# Altium schematic sheet zx-SD-Card_SPI.SchDoc
size 420 x 297 mm
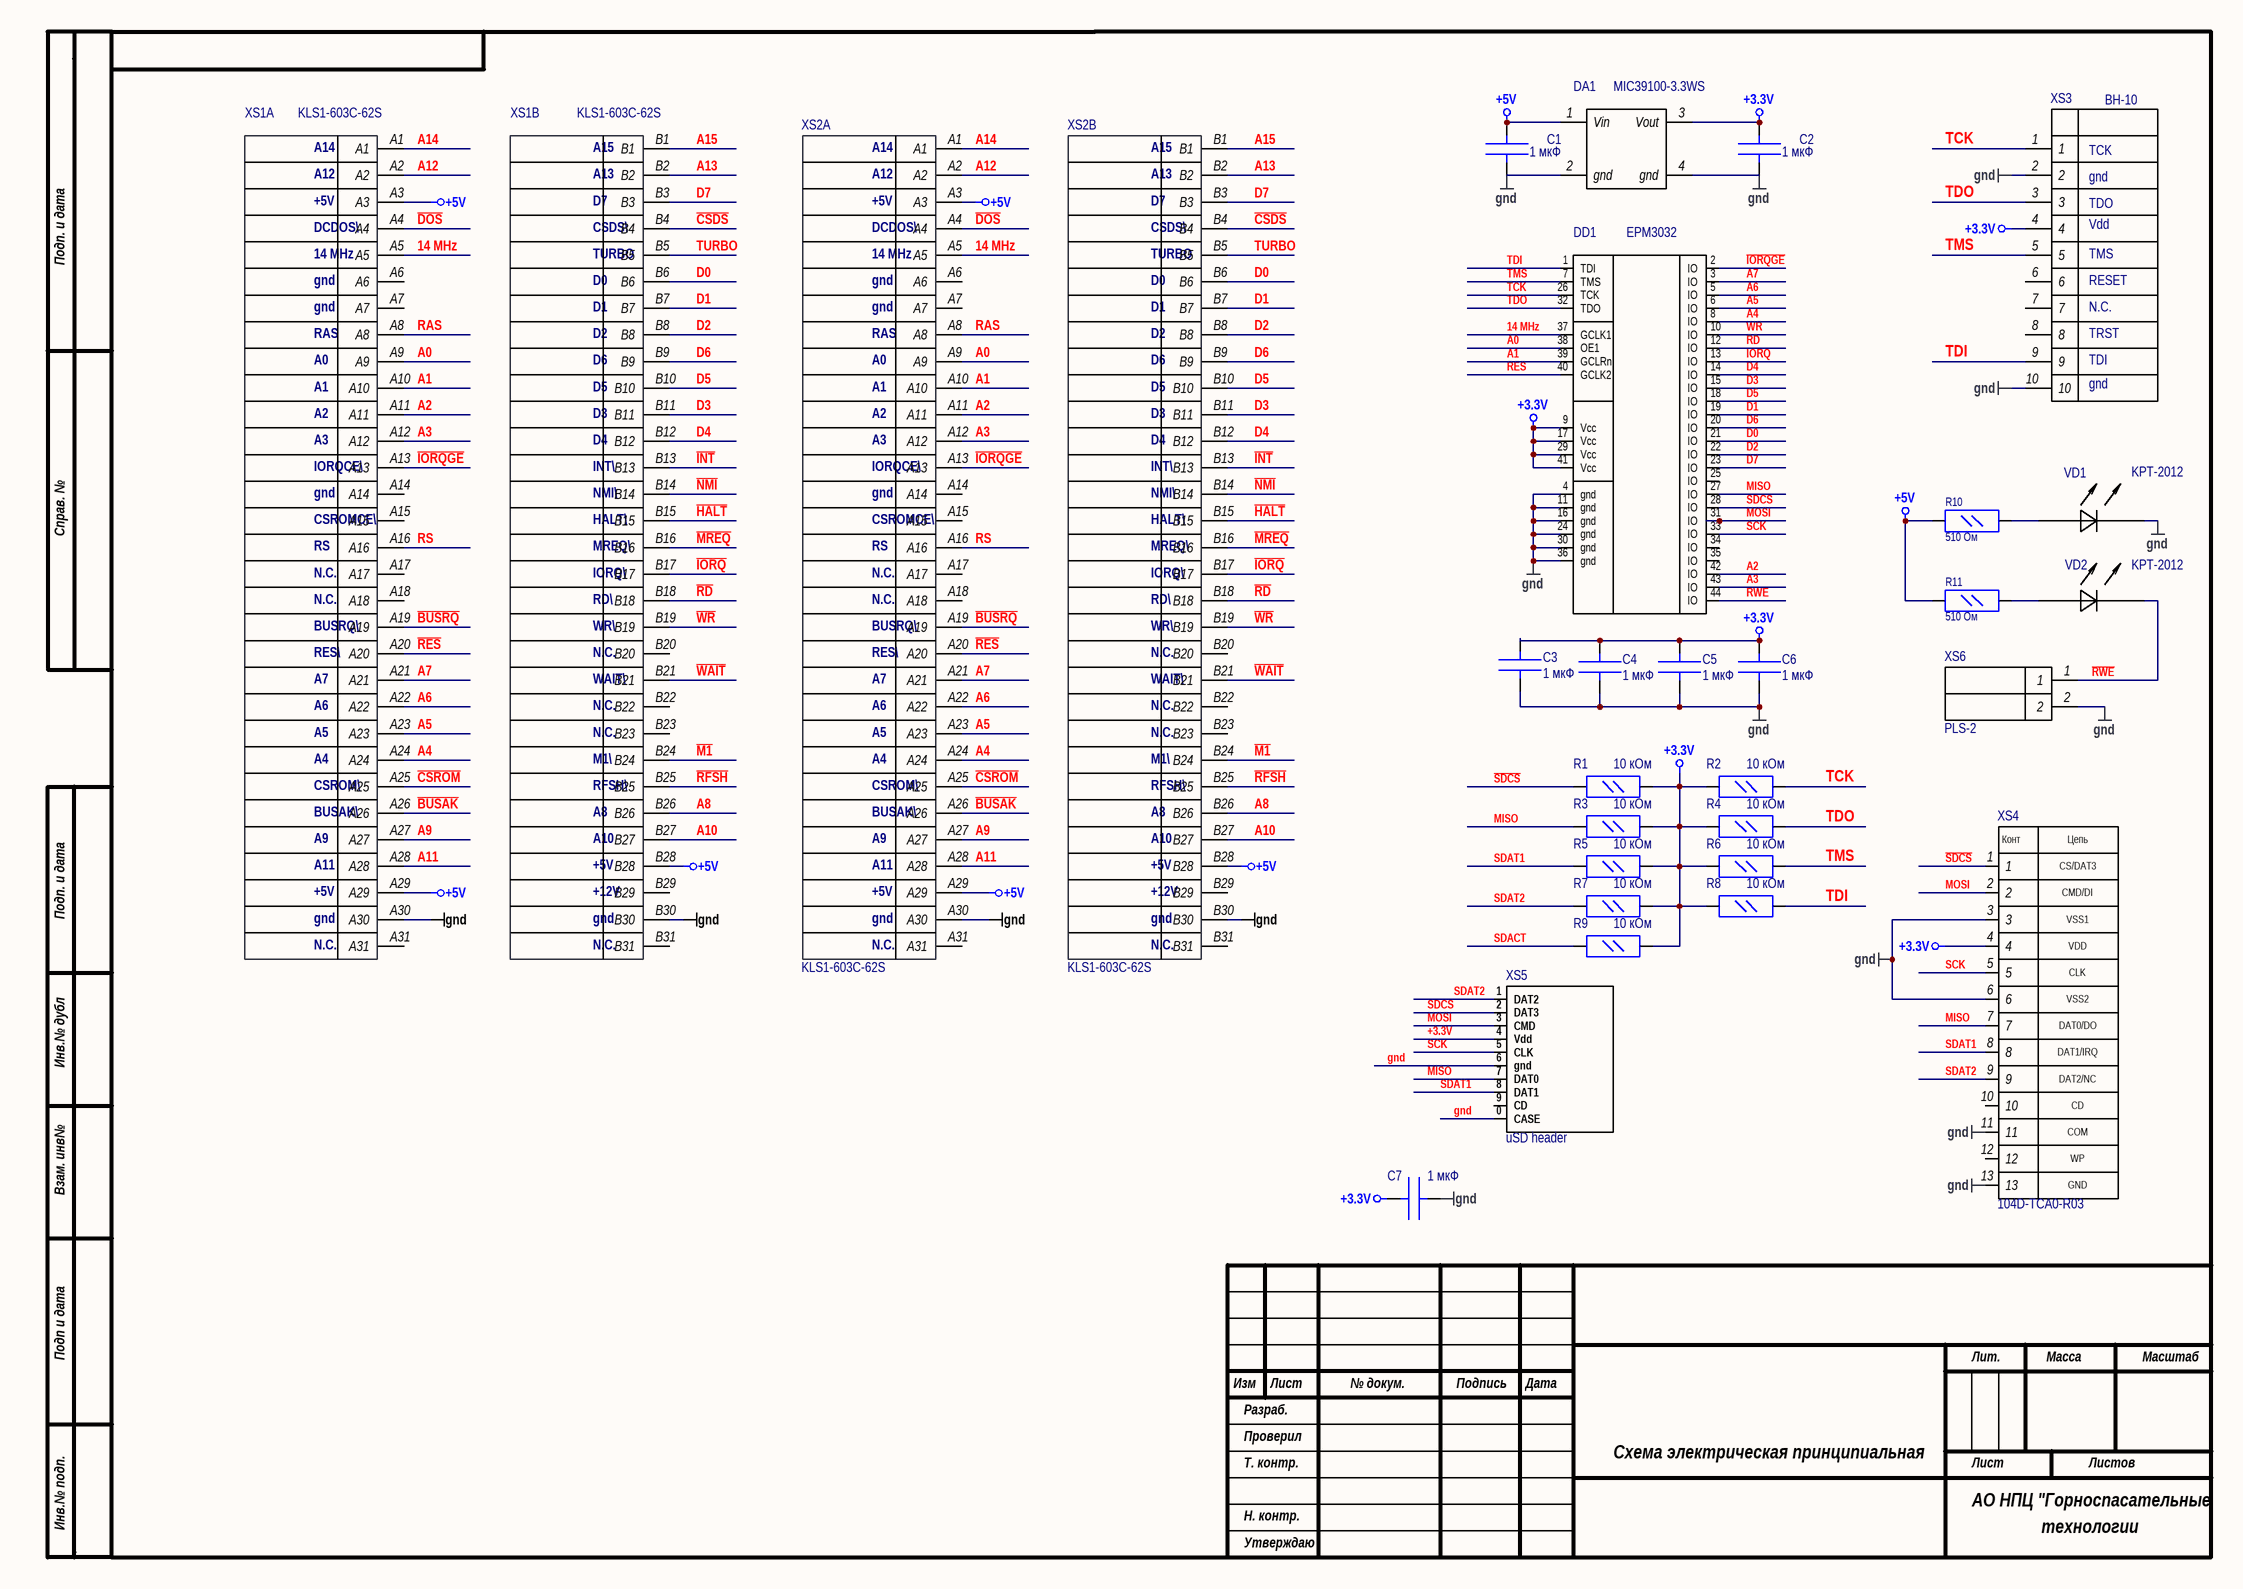
[diagram p0: zx-SD-Card_SPI.SchDoc]

## Parts
C1  1 мкФ  [CAP C 3216 (1206) 1.9h]
C2  1 мкФ  [CAP C 3216 (1206) 1.9h]
C3  1 мкФ  [CAP C 2012 (0805) 1.45h]
C4  1 мкФ  [CAP C 2012 (0805) 1.45h]
C5  1 мкФ  [CAP C 2012 (0805) 1.45h]
C6  1 мкФ  [CAP C 2012 (0805) 1.45h]
C7  1 мкФ  [CAP C 2012 (0805) 1.45h]
DA1  MIC39100-3.3WS  [MIC39100-3.3WS]
DD1  EPM3032  [ALTERA TQFP-44]
R1  10 кОм  [RES C 2012 (0805) 0.65h]
R2  10 кОм  [RES C 2012 (0805) 0.65h]
R3  10 кОм  [RES C 2012 (0805) 0.65h]
R4  10 кОм  [RES C 2012 (0805) 0.65h]
R5  10 кОм  [RES C 2012 (0805) 0.65h]
R6  10 кОм  [RES C 2012 (0805) 0.65h]
R7  10 кОм  [RES C 2012 (0805) 0.65h]
R8  10 кОм  [RES C 2012 (0805) 0.65h]
R9  10 кОм  [RES C 2012 (0805) 0.65h]
R10  510 Ом  [RES C 2012 (0805) 0.65h]
R11  510 Ом  [RES C 2012 (0805) 0.65h]
VD1  KPT-2012  [KPT-2012]
VD2  KPT-2012  [KPT-2012]
XS1  KLS1-603C-62S  [KLS1-603 ISA]  (parts A,B of 2)
XS2  KLS1-603C-62S  [KLS1-603C-64S]  (parts A,B of 2)
XS3  BH-10  [BH-10]
XS4  104D-TCA0-R03  [104D-TCA0-R03]
XS5  uSD header  [uSD]
XS6  PLS-2  [PLS-2]

## Nets
+3.3V: C2.2 C3.1 C4.1 C5.1 C6.1 C7.1 DA1.3(Vout) DD1.9(Vcc) DD1.17(Vcc) DD1.29(Vcc) DD1.41(Vcc) R1.2 R2.1 R3.2 R4.1 R5.2 R6.1 R7.2 R8.1 R9.2 XS3.4 XS4.4 XS5.4(Vdd)
+5V: C1.2 DA1.1(Vin) R10.1 R11.1 XS1.A3 XS1.A29 XS1.B28 XS2.A3 XS2.A29 XS2.B28
gnd: C1.1 C2.1 C3.2 C4.2 C5.2 C6.2 C7.2 DA1.2(gnd) DA1.4(gnd) DD1.4(gnd) DD1.11(gnd) DD1.16(gnd) DD1.24(gnd) DD1.30(gnd) DD1.36(gnd) VD1.2 XS1.A30 XS1.B30 XS2.A30 XS2.B30 XS3.2 XS3.10 XS4.3 XS4.6 XS4.11 XS4.13 XS5.0(CASE) XS5.6(gnd) XS6.2
14 MHz: DD1.37(GCLK1) XS1.A5 XS2.A5
A0: DD1.38(OE1) XS1.A9 XS2.A9
A1: DD1.39(GCLRn) XS1.A10 XS2.A10
A2: DD1.42(IO) XS1.A11 XS2.A11
A3: DD1.43(IO) XS1.A12 XS2.A12
A4: DD1.8(IO) XS1.A24 XS2.A24
A5: DD1.6(IO) XS1.A23 XS2.A23
A6: DD1.5(IO) XS1.A22 XS2.A22
A7: DD1.3(IO) XS1.A21 XS2.A21
A8: XS1.B26 XS2.B26
A9: XS1.A27 XS2.A27
A10: XS1.B27 XS2.B27
A11: XS1.A28 XS2.A28
A12: XS1.A2 XS2.A2
A13: XS1.B2 XS2.B2
A14: XS1.A1 XS2.A1
A15: XS1.B1 XS2.B1
~{BUSAK}: XS1.A26 XS2.A26
~{BUSRQ}: XS1.A19 XS2.A19
~{CSDS}: XS1.B4 XS2.B4
~{CSROM}: XS1.A25 XS2.A25
D0: DD1.21(IO) XS1.B6 XS2.B6
D1: DD1.19(IO) XS1.B7 XS2.B7
D2: DD1.22(IO) XS1.B8 XS2.B8
D3: DD1.15(IO) XS1.B11 XS2.B11
D4: DD1.14(IO) XS1.B12 XS2.B12
D5: DD1.18(IO) XS1.B10 XS2.B10
D6: DD1.20(IO) XS1.B9 XS2.B9
D7: DD1.23(IO) XS1.B3 XS2.B3
~{DOS}: XS1.A4 XS2.A4
~{HALT}: XS1.B15 XS2.B15
~{INT}: XS1.B13 XS2.B13
~{IORQ}: DD1.13(IO) XS1.B17 XS2.B17
~{IORQGE}: DD1.2(IO) XS1.A13 XS2.A13
~{M1}: XS1.B24 XS2.B24
~{MREQ}: XS1.B16 XS2.B16
MISO: DD1.27(IO) R3.1 XS4.7 XS5.7(DAT0)
MOSI: DD1.31(IO) XS4.2 XS5.3(CMD)
~{NMI}: XS1.B14 XS2.B14
~{RD}: DD1.12(IO) XS1.B18 XS2.B18
~{RES}: DD1.40(GCLK2) XS1.A20 XS2.A20
~{RFSH}: XS1.B25 XS2.B25
~{RWE}: DD1.44(IO) VD2.2 XS6.1
RAS: XS1.A8 XS2.A8
RS: XS1.A16 XS2.A16
~{SDCS}: DD1.28(IO) R1.1 XS4.1 XS5.2(DAT3)
SCK: DD1.33(IO) XS4.5 XS5.5(CLK)
SDACT: R9.1
SDAT1: R5.1 XS4.8 XS5.8(DAT1)
SDAT2: R7.1 XS4.9 XS5.1(DAT2)
TCK: DD1.26(TCK) R2.2 XS3.1
TDI: DD1.1(TDI) R8.2 XS3.9
TDO: DD1.32(TDO) R4.2 XS3.3
TMS: DD1.7(TMS) R6.2 XS3.5
TURBO: XS1.B5 XS2.B5
~{WAIT}: XS1.B21 XS2.B21
~{WR}: DD1.10(IO) XS1.B19 XS2.B19
NetR10_2: R10.2 VD1.1
NetR11_2: R11.2 VD2.1

Not connected (* = marked no-connect by the designer): DD1 25(IO) 34(IO) 35(IO); XS1 A6 A7 A14 A15 A17 A18 A31 B20 B22 B23 B29 B31; XS2 A6 A7 A14 A15 A17 A18 A31 B20 B22 B23 B29 B31; XS3 6 7 8; XS4 10 12; XS5 9(CD)

## Notes on the sheet
- Подп. и дата
- Справ. №
- Инв.№ дубл
- Взам. инв№
- Подп и дата
- Изм
- Лист
- № докум.
- Подпись
- Дата
- Лит.
- Масса
- Масштаб
- Разраб.
- Проверил
- Т. контр.
- Схема электрическая принципиальная
- Листов
- Инв.№ подп.
- Н. контр.
- АО НПЦ "Горноспасательные
- технологии
- Утверждаю
- (in symbol 104D-TCA0-R03) Конт; Цепь; CS/DAT3; CMD/DI; VSS1; VDD; CLK; VSS2; DAT0/DO; DAT1/IRQ; DAT2/NC; CD; COM; WP; GND
- (in symbol AVR_ISP_JTAG) TCK; gnd; TDO; Vdd; TMS; RESET; N.C.; TRST; TDI
- (in symbol KLS1-603C-64S, part A) +5V; DCDOS\; 14 MHz; gnd; RAS; A0; IORQCE\; CSROMCE\; RS; N.C.; BUSRQ\; RES\; CSROM\; BUSAK\
- (in symbol KLS1-603C-64S, part B) D7; CSDS\; TURBO; D0; D1; D2; D6; D5; D3; D4; INT\; NMI\; HALT\; MREQ\; IORQ\; RD\; WR\; N.C.; WAIT\; M1\; RFSH\; +5V; +12V; gnd

## Library data of the parts
C1 C2 = ЧИП-1206-X5R-1 мкФ 50В ±10%: Конденсатор не полярный; Part Number: CC1206KKX5R9BB105; Manufacturer: Yageo; AltValue: 1; Nominal: 1000000; Voltage: 50; Tolerance: ±10%; Standard sizes of packages: 3216 (1206); Dielectric: X5R; Note: Конденсатор типоразмер 3216 (1206), general purpose; FullName: ЧИП-1206-X5R-1 мкФ 50В ±10%; Name: ЧИП-1206; Value: 1 мкФ; Units: мкФ
C3-C7 = ЧИП-0805-X5R-1 мкФ 50В ±10%: Конденсатор не полярный; Part Number: CC0805KKX5R9BB105; Manufacturer: Yageo; AltValue: 1; Nominal: 1000000; Voltage: 50; Tolerance: ±10%; Standard sizes of packages: 2012 (0805); Dielectric: X5R; Note: Конденсатор типоразмер 2012 (0805), general purpose; FullName: ЧИП-0805-X5R-1 мкФ 50В ±10%; Name: ЧИП-0805; Value: 1 мкФ; Units: мкФ
DA1 = MIC39100-3.3WS: LDO 3.3V 1A
R1-R9 = ЧИП-0805-10 кОм ±1%: Резистор 0.125 Вт; Part Number: RC0805FR-0710KL; Manufacturer: Yageo; AltValue: 10; Nominal: 10000; Tolerance: ±1%; Power: 1/8W (0.125W); Standard sizes of packages: 2012 (0805); Note: Резистор постоянный, 0805; FullName: ЧИП-0805-10 кОм ±1%; Name: ЧИП-0805; Value: 10 кОм; Units: кОм
R10 R11 = ЧИП-0805-510 Ом ±5%: Резистор 0.125 Вт; Part Number: RC0805JR-07510RL; Manufacturer: Yageo; AltValue: 510; Tolerance: ±5%; Power: 1/8W (0.125W); Standard sizes of packages: 2012 (0805); Note: Резистор постоянный, 0805; FullName: ЧИП-0805-510 Ом ±5%; Name: ЧИП-0805; Value: 510 Ом; Units: Ом; Nominal: 510
XS1 XS2 = KLS1-603C-64S
XS3 = AVR_ISP_JTAG
XS4 = 104D-TCA0-R03: Manufacturer: Attend technology; Note: Разъем для SD карты; FullName: 104D-TCA0-R03; Value: 104D-TCA0-R03; Part Number: 104D-TCA0-R03; Help URL: www.attend.com.tw
XS5 = uSD